# Altium schematic sheet 2 - IO Socket 0.SchDoc
size A4
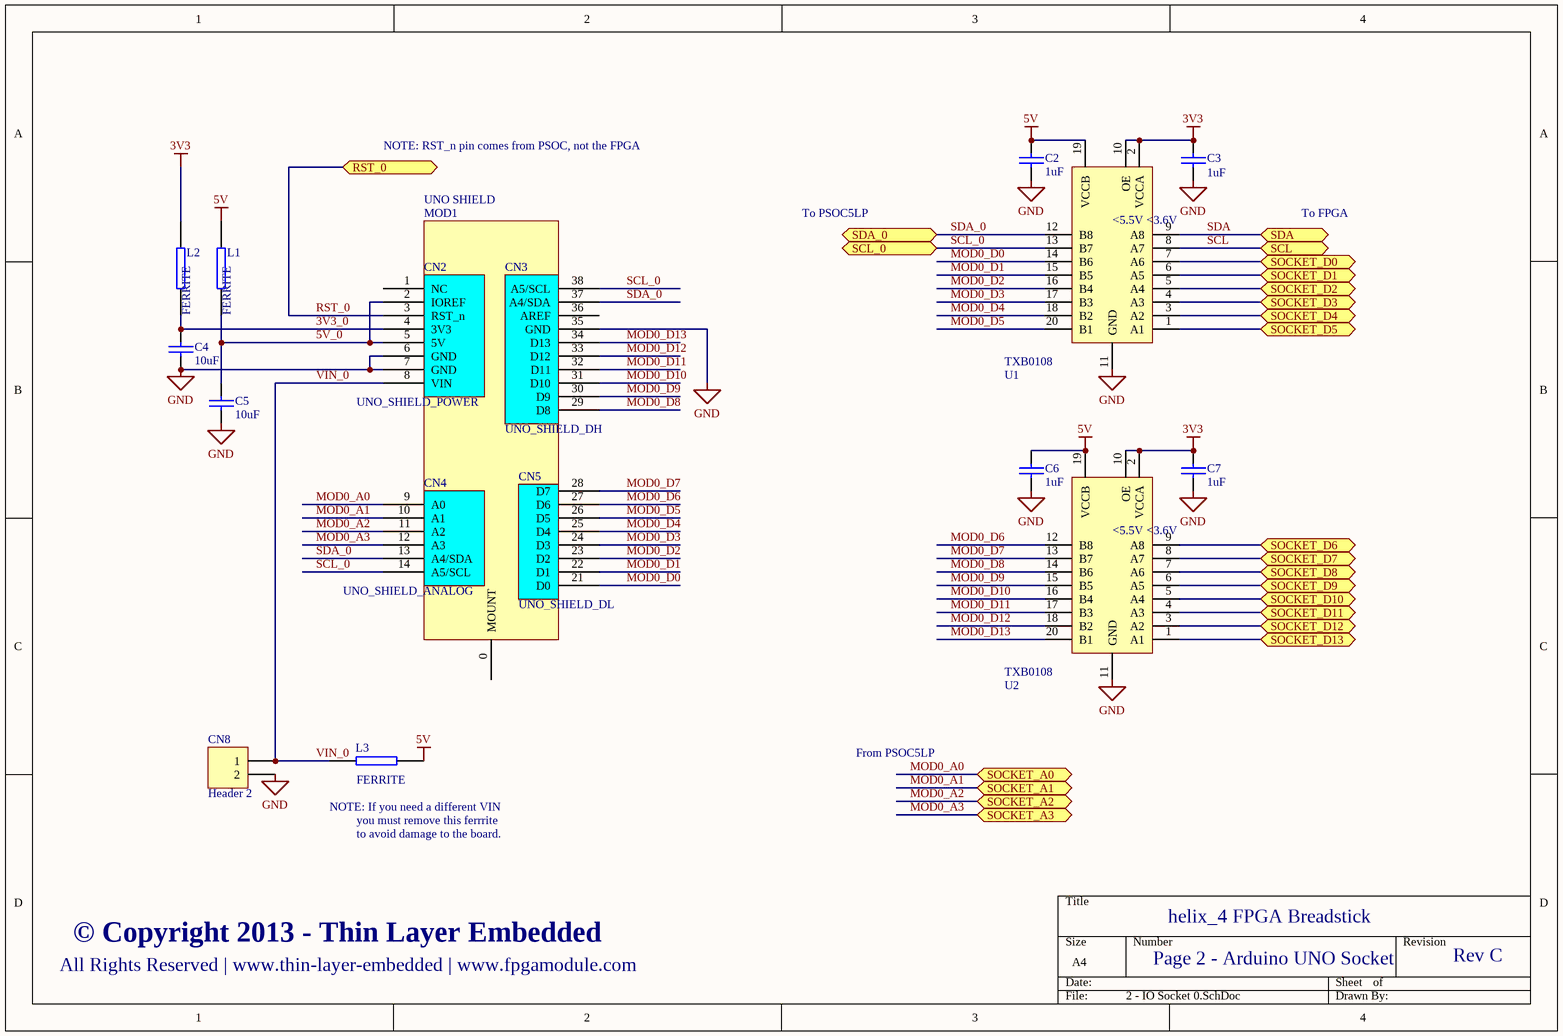
[diagram p0: 2 - IO Socket 0.SchDoc]

## Parts
C2  1uF  [0805]
C3  1uF  [0805]
C4  10uF  [0805]
C5  10uF  [0805]
C6  1uF  [0805]
C7  1uF  [0805]
CN2  UNO_SHIELD_POWER  [UNO_SHIELD_POWER]
CN3  UNO_SHIELD_DH  [UNO_SHIELD_DH]
CN4  UNO_SHIELD_ANALOG  [UNO_SHIELD_ANALOG]
CN5  UNO_SHIELD_DL  [UNO_SHIELD_DL]
CN8  Header 2  [HDR1X2]
L1  FERRITE  [0805]
L2  FERRITE  [0805]
L3  FERRITE  [0805]
MOD1  UNO SHIELD  [UNO_SHIELD_MECH_NO_OUTLINE]
U1  TXB0108  [TSSOP20]
U2  TXB0108  [TSSOP20]

## Ports
RST_0, SCL, SCL_0, SDA, SDA_0, SOCKET_A0, SOCKET_A1, SOCKET_A2, SOCKET_A3, SOCKET_D0, SOCKET_D1, SOCKET_D2, SOCKET_D3, SOCKET_D4, SOCKET_D5, SOCKET_D6, SOCKET_D7, SOCKET_D8, SOCKET_D9, SOCKET_D10, SOCKET_D11, SOCKET_D12, SOCKET_D13

## Nets
3V3: C3.2 C7.2 L2.1 U1.2(VCCA) U1.10(OE) U2.2(VCCA) U2.10(OE)
5V: C2.2 C6.2 L1.1 L3.1 U1.19(VCCB) U2.19(VCCB)
GND: C2.1 C3.1 C4.2 C5.2 C6.1 C7.1 CN2.6(GND) CN2.7(GND) CN3.35(GND) CN8.2 U1.11(GND) U2.11(GND)
3V3_0: C4.1 CN2.4(3V3) L2.2
5V_0: C5.1 CN2.2(IOREF) CN2.5(5V) L1.2
MOD0_A0: CN4.9(A0) ; port SOCKET_A0
MOD0_A1: CN4.10(A1) ; port SOCKET_A1
MOD0_A2: CN4.11(A2) ; port SOCKET_A2
MOD0_A3: CN4.12(A3) ; port SOCKET_A3
MOD0_D0: CN5.21(D0) U1.14(B6)
MOD0_D1: CN5.22(D1) U1.15(B5)
MOD0_D2: CN5.23(D2) U1.16(B4)
MOD0_D3: CN5.24(D3) U1.17(B3)
MOD0_D4: CN5.25(D4) U1.18(B2)
MOD0_D5: CN5.26(D5) U1.20(B1)
MOD0_D6: CN5.27(D6) U2.12(B8)
MOD0_D7: CN5.28(D7) U2.13(B7)
MOD0_D8: CN3.29(D8) U2.14(B6)
MOD0_D9: CN3.30(D9) U2.15(B5)
MOD0_D10: CN3.31(D10) U2.16(B4)
MOD0_D11: CN3.32(D11) U2.17(B3)
MOD0_D12: CN3.33(D12) U2.18(B2)
MOD0_D13: CN3.34(D13) U2.20(B1)
RST_0: CN2.3(RST_n) ; port RST_0
SCL: U1.8(A7) ; port SCL
SCL_0: CN3.38(A5/SCL) CN4.14(A5/SCL) U1.13(B7) ; port SCL_0
SDA: U1.9(A8) ; port SDA
SDA_0: CN3.37(A4/SDA) CN4.13(A4/SDA) U1.12(B8) ; port SDA_0
SOCKET_D0: U1.7(A6) ; port SOCKET_D0
SOCKET_D1: U1.6(A5) ; port SOCKET_D1
SOCKET_D2: U1.5(A4) ; port SOCKET_D2
SOCKET_D3: U1.4(A3) ; port SOCKET_D3
SOCKET_D4: U1.3(A2) ; port SOCKET_D4
SOCKET_D5: U1.1(A1) ; port SOCKET_D5
SOCKET_D6: U2.9(A8) ; port SOCKET_D6
SOCKET_D7: U2.8(A7) ; port SOCKET_D7
SOCKET_D8: U2.7(A6) ; port SOCKET_D8
SOCKET_D9: U2.6(A5) ; port SOCKET_D9
SOCKET_D10: U2.5(A4) ; port SOCKET_D10
SOCKET_D11: U2.4(A3) ; port SOCKET_D11
SOCKET_D12: U2.3(A2) ; port SOCKET_D12
SOCKET_D13: U2.1(A1) ; port SOCKET_D13
VIN_0: CN2.8(VIN) CN8.1 L3.2

Not connected (* = marked no-connect by the designer): CN2 1(NC); CN3 36(AREF); MOD1 0(MOUNT)

## Notes on the sheet
- NOTE: RST_n pin comes from PSOC, not the FPGA
- To PSOC5LP
- To FPGA
- From PSOC5LP
- (near L3) NOTE: If you need a different VIN
- you must remove this ferrrite
- to avoid damage to the board.
- helix_4 FPGA Breadstick
- All Rights Reserved | www.thin-layer-embedded | www.fpgamodule.com
- © Copyright 2013 - Thin Layer Embedded
- Page 2 - Arduino UNO Socket
- Rev C
- (in symbol TXB0108) <5.5V; <3.6V

## Library data of the parts
C2-C7 = CAP: Capacitor
CN8 = Header 2: Header, 2-Pin; LatestRevisionDate: 17-Jul-2002; LatestRevisionNote: Re-released for DXP Platform.; Publisher: Altium Limited
MOD1 = UNO_SHIELD_MECH
U1 U2 = TXB0108: TI Bir-dir buffer